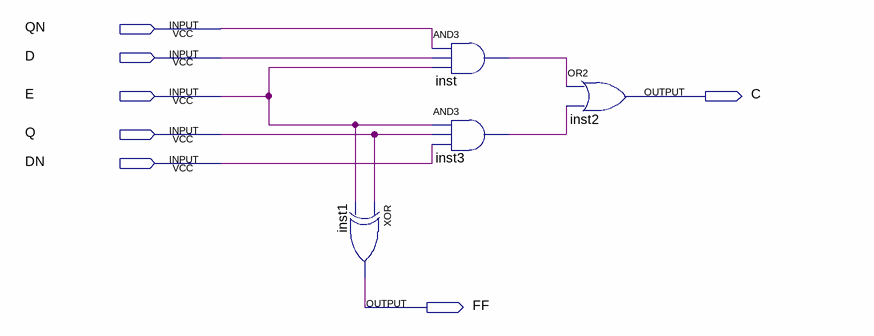
[diagram p0: schematic sheet]
// Quartus schematic has.bdf as structural Verilog: 4 symbols, 7 pins
module has (
  input  QN,
  input  D,
  input  E,
  input  Q,
  input  DN,
  output C,
  output FF
);

  wire inst3_out, inst_out;

  xor inst1 (FF, Q, E);
  and inst (inst_out, QN, D, E);
  and inst3 (inst3_out, E, Q, DN);
  or inst2 (C, inst_out, inst3_out);
endmodule
